# Altium schematic sheet 03_POWER1.SchDoc: =TitleParameter
size A3; Organization: ASISGUARD; Address1: Kemalpasa, Kemalpasa Cd. No:290 D:292H, 35060 Bornova/Izmir/Turkey; SheetNumber: 3; SheetTotal: 14
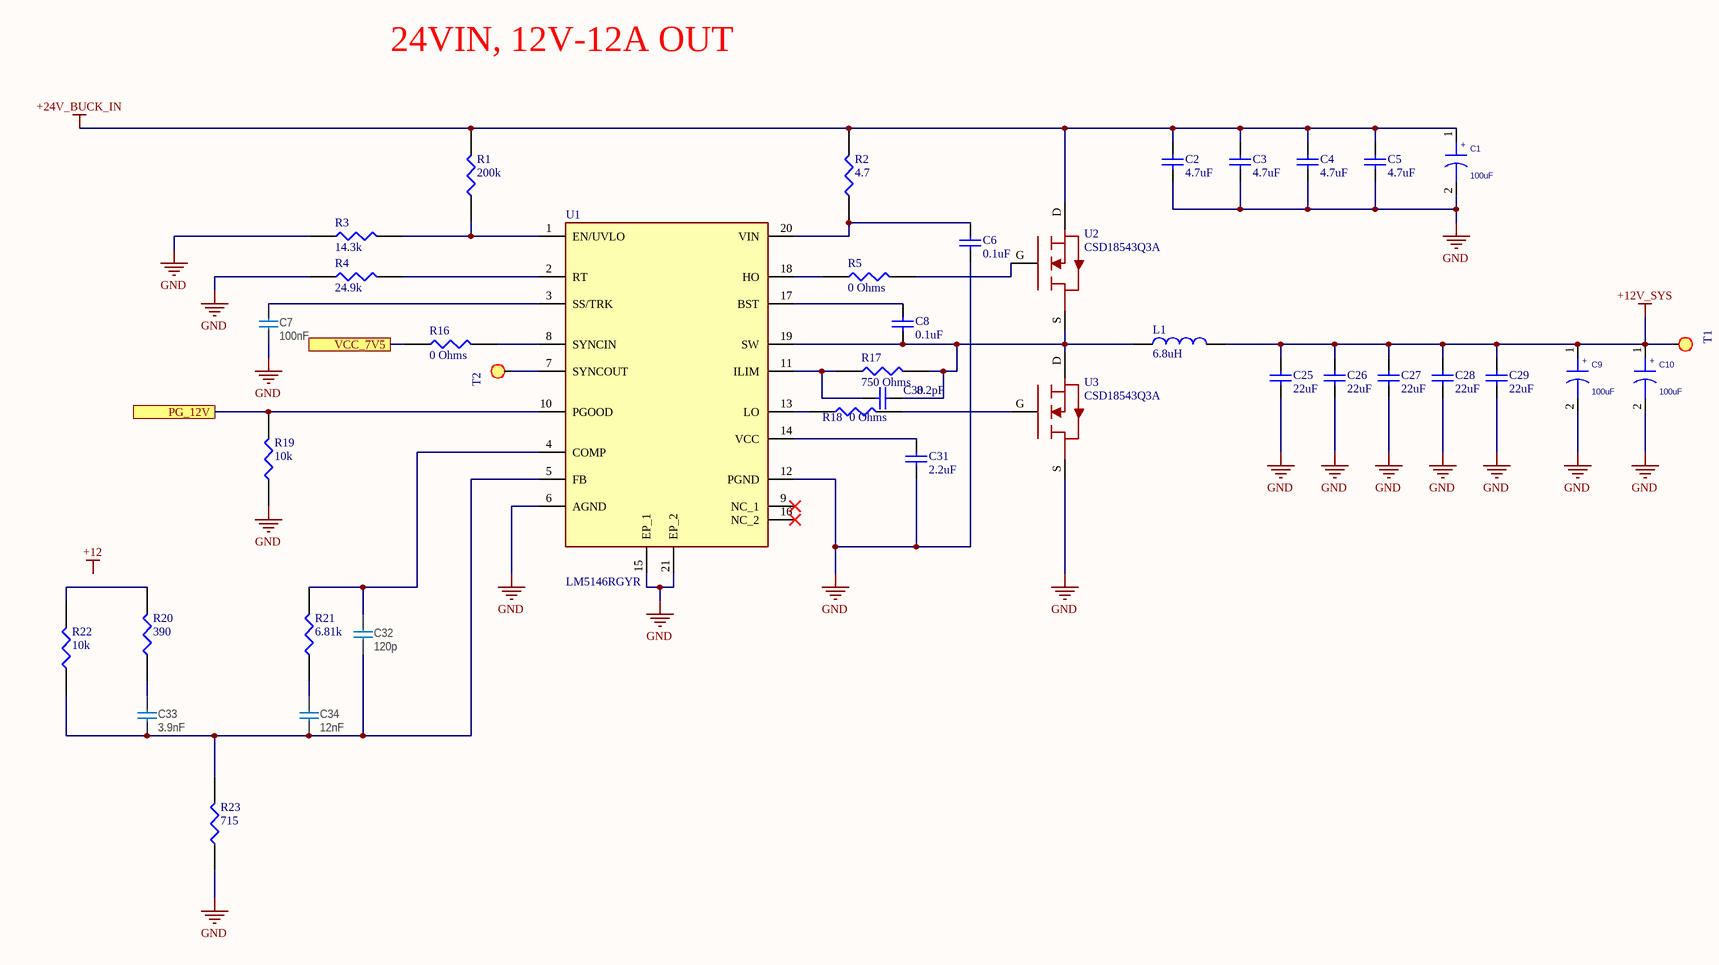
[diagram p0: 03_POWER1.SchDoc]

## Parts
C1  100uF  [SMD 10.3x10.3x10.0mm]
C2  4.7uF  [CAP1206]
C3  4.7uF  [CAP1206]
C4  4.7uF  [CAP1206]
C5  4.7uF  [CAP1206]
C6  0.1uF  [0402_C]
C7  100nF  [CAPC0603X03L_C]
C8  0.1uF  [0402_C]
C9  100uF  [SMD 10.3x10.3x10.0mm]
C10  100uF  [SMD 10.3x10.3x10.0mm]
C25  22uF  [CAP1206]
C26  22uF  [CAP1206]
C27  22uF  [CAP1206]
C28  22uF  [CAP1206]
C29  22uF  [CAP1206]
C30  value 8.2pF  [SMC0603]  (hidden comment: CAP CER 8.2PF 50V C0G/NPO 0603)
C31  value 2.2uF  [SMC0603]  (hidden comment: CAP CER 4.7UF 25V X5R 0603)
C32  120p  [CAPC0603X03L_C]
C33  3.9nF  [CAPC0603X03L_C]
C34  12nF  [CAPC0603X03L_C]
L1  6.8uH  [SRU10386R2Y]
R1  200k  [0805]
R2  4.7  [0805]
R3  14.3k  [0805]
R4  24.9k  [0805]
R5  0 Ohms  [0805]
R16  0 Ohms  [0805]
R17  750 Ohms  [0805]
R18  0 Ohms  [0805]
R19  10k  [0805]
R20  390  [0805]
R21  6.81k  [0805]
R22  10k  [0805]
R23  715  [0805]
T1  SMD  [TEST_POINT]  (value not drawn)
T2  SMD  [TEST_POINT]  (value not drawn)
U1  LM5146RGYR  [LM5146RGYR]
U2  CSD18543Q3A  [CSD18543Q3A]
U3  CSD18543Q3A  [CSD18543Q3A]

## Ports
PG_12V, VCC_7V5

## Nets
+12V_SYS: C9.1 C10.1 C25.2 C26.2 C27.2 C28.2 C29.2 L1.2 T1.1(TP)
+24V_BUCK_IN: C1.1 C2.2 C3.2 C4.2 C5.2 R1.2 R2.2 U2.D
GND: C1.2 C2.1 C3.1 C4.1 C5.1 C6.1 C7.1 C9.2 C10.2 C25.1 C26.1 C27.1 C28.1 C29.1 C31.1 R3.1 R4.1 R19.1 R23.1 U1.6(AGND) U1.12(PGND) U1.15(EP_1) U1.21(EP_2) U3.S
PG_12V: R19.2 U1.10(PGOOD) ; port PG_12V
VCC_7V5: R16.1 ; port VCC_7V5
NetC6_2: C6.2 R2.1 U1.20(VIN)
NetC7_2: C7.2 U1.3(SS/TRK)
NetC8_1: C8.1 C30.2 L1.1 R17.2 U1.19(SW) U2.S U3.D
NetC8_2: C8.2 U1.17(BST)
NetC30_1: C30.1 R17.1 U1.11(ILIM)
NetC31_2: C31.2 U1.14(VCC)
NetC32_1: C32.1 C33.1 C34.1 R22.1 R23.2 U1.5(FB)
NetC32_2: C32.2 R21.2 U1.4(COMP)
NetC33_2: C33.2 R20.1
NetC34_2: C34.2 R21.1
NetR1_1: R1.1 R3.2 U1.1(EN/UVLO)
NetR4_2: R4.2 U1.2(RT)
NetR5_1: R5.1 U1.18(HO)
NetR5_2: R5.2 U2.G
NetR16_2: R16.2 U1.8(SYNCIN)
NetR18_1: R18.1 U1.13(LO)
NetR18_2: R18.2 U3.G
NetR20_2: R20.2 R22.2
NetT2_1: T2.1(TP) U1.7(SYNCOUT)

Not connected (* = marked no-connect by the designer): U1 9(NC_1)* 16(NC_2)*

## Notes on the sheet
- 24VIN, 12V-12A OUT
- Labels drawn without touching a wire or pin: +12
- Proje/Project:
- Sayfa Adı/Document Name:
- Çizilme Tarihi/Drawing Date
- Umit KAYACIK
- Tasarlayan/Designed By
- Sayfa/Sheet:
- Revision:
- of
- Son Güncelleme/Last Edit Date
- Kontrol eden/Checked By
- Onaylayan/Approved By
- Boyut/Size:
- Varyant/Variant:
- Dil/Language:
- A3
- ENG
- (in symbol 150uF-6.3V-20%-AL-LOESR-SMD_5x6_5) +

## Library data of the parts
C1 C9 C10 = 150uF-6.3V-20%-AL-LOESR-SMD_5x6_5: CAP ALUM POLY 100UF 20% 50V SMD; Manufacturer: Nichicon; Manufacturer Part Number: PCV1H101MCL2GS; Value: 100uF; Supplier Part Number: 493-4558-1-ND
C2-C5 = CAP1206_4.7uF_100V: 4.7 µF ±10% 100V Ceramic Capacitor X7S 1206 (3216 Metric); Manufacturer Part Number: 12061Z475KAT2A; Value: 4.7uF 100V; Order Code: DIGI : 445-180362-1-ND
C6 C8 = Cap: CAP CER 0.1UF 50V X7R 0402; Manufacturer: TDK Corporation; Manufacturer Part Number: C1005X7R1H104K050BB; Value: 0.1uF; Supplier Part Number: 445-5932-1-ND
C7 = C0201-100n: Capacitor, X5R, ±10%; Manufacturer: N.A.; Part number IPS: 00000001248, 00000002505; Part number Norautron: 262071862; Part number NEMS: 100200078; Note: 16V; Pad Count: 2; Component Status: Active; Part Number: C0201-100n; Manufacturer Part Number: N.A.; ComponentLink1URL: N.A.; ComponentLink1Description: Datasheet; ComponentLink2URL: N.A.; ComponentLink2Description: Supplier link; HelpURL: N.A.; Footprint Doc: 0201; LatestRevisionDate: 2017-11-09; Published: 2014-11-13; Value: 100nF; Supplier 1: N.A.; Supplier Part Number 1: N.A.; Supplier 2: N.A.; Supplier Part Number 2: N.A.; Artikkelnr Noca: N.A.; PartId: 100200078; Component Class: Capacitors; Author: rsk
C25-C29 = CAP1206_22uF_35V: 22 µF ±20% 35V Ceramic Capacitor X5R 1206 (3216 Metric); Manufacturer Part Number: C3216X5R1V226M160AC; Value: 22uF 35V; Order Code: DIGI : 445-180362-1-ND
C30 = CAP0603_8.2PF_50V: 8.2 pF ±0.25pF 50V Ceramic Capacitor C0G, NP0 0603 (1608 Metric); Manufacturer Part Number: CC0603CRNPO9BN8R2; Order Code: DIGI : 311-3865-2-ND; LCSC Manufacturer Part Number: CC0603CRNPO9BN8R2; LCSC Part Number: C277519
C31 = CAP0603_2.2UF_16V: 2.2 µF ±10% 16V Ceramic Capacitor X7S 0603 (1608 Metric); Manufacturer Part Number: GRT188C71C225KE13D; Order Code: DIGI: 490-GRT188C71C225KE13DTR-ND
C32-C34 = C0201-100n: Capacitor, X5R, ±10%; Manufacturer: N.A.; Part number IPS: 00000001248, 00000002505; Part number Norautron: 262071862; Part number NEMS: 100200078; Value: 100nF; Note: 16V; Pad Count: 2; Component Status: Active; Part Number: C0201-100n; Manufacturer Part Number: N.A.; ComponentLink1URL: N.A.; ComponentLink1Description: Datasheet; ComponentLink2URL: N.A.; ComponentLink2Description: Supplier link; HelpURL: N.A.; Footprint Doc: 0201; LatestRevisionDate: 2017-11-09; Published: 2014-11-13; Supplier 1: N.A.; Supplier Part Number 1: N.A.; Supplier 2: N.A.; Supplier Part Number 2: N.A.; Artikkelnr Noca: N.A.; PartId: 100200078; Component Class: Capacitors; Author: rsk
L1 = IND_6.2uH_4A: 6.2 µH Shielded Drum Core, Wirewound Inductor 4 A 16.5mOhm Nonstandard; Manufacturer_Name: Bourns; Manufacturer Part Number: SRU1038-6R2Y; Geometry.Height: 6.1mm; Mouser Part Number: 652-SRU1038-6R2Y; Mouser Price/Stock: https://www.mouser.co.uk/ProductDetail/Bourns/SRU1038-6R2Y?qs=q9ZR8LvBB%2FuBaClm0822pQ%3D%3D; Arrow Part Number: SRU1038-6R2Y; Arrow Price/Stock: https://www.arrow.com/en/products/sru1038-6r2y/bourns; Datasheet Link: https://www.mouser.com/datasheet/2/54/sru1038-1391493.pdf
R1-R5 R16-R23 = 0805W8F2003T5E: -55℃~+155℃ 125mW 150V 200kΩ Thick Film Resistor ±1% ±100ppm/℃ 0805 Chip Resistor - Surface Mount ROHS
T1 T2 = TP_15: DESIG: testing PAD; FAB: NA; VAL: NOT POPULATED; PCB Footprint: test0_8-smd; REF: NA
U1 = LM5146RGYR: Buck Regulator Positive Output Step-Down DC-DC Controller IC 20-VQFN (3.5x4.5); Manufacturer: Texas Instruments; Supplier: Digi; 296-LM5146RGYRDKR-ND
U2 U3 = CSD18543Q3A: N-Channel 60 V 60A (Tc) 66W (Tc) Surface Mount 8-VSONP (3x3.3)